# EAGLE design Marklin BR 128 21MTC Adapter (EAGLE 9.6.2)
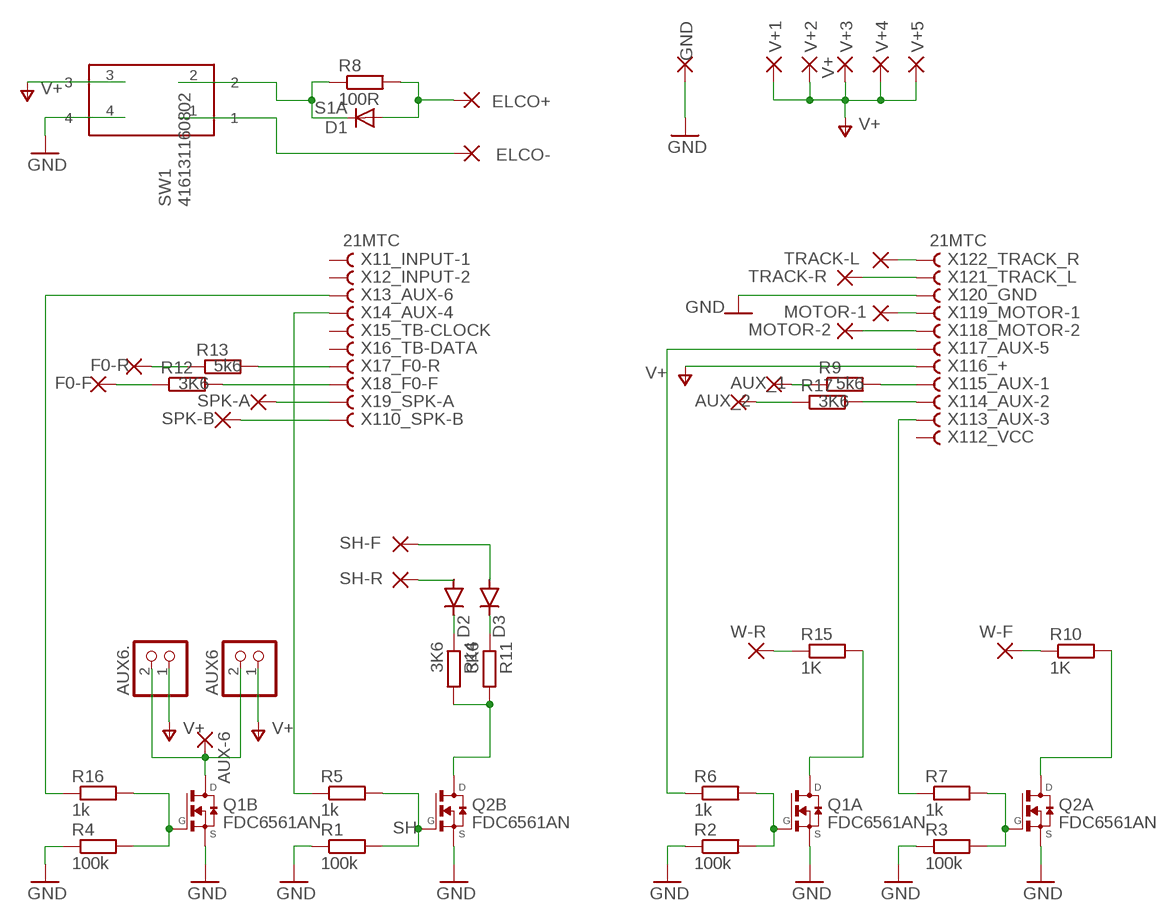
[diagram p0: schematic, sheet 1]

## Parts
AUX6  JST_2PIN-THM-RA  [JST-PH-2-THM-RA]
AUX6.  JST_2PIN-THM-RA  [JST-PH-2-THM-RA]
AUX-6  SMD2  [SMD1,27-2,54]
AUX_1  SMD2  [SMD1,27-2,54]
AUX_2  SMD2  [SMD1,27-2,54]
D1  S1A  [DO214AC]
D2  S1M  [SMA]
D3  S1M  [SMA]
ELCO+  SMD2  [SMD1,27-2,54]
ELCO-  SMD2  [SMD1,27-2,54]
F0-F  SMD2  [SMD1,27-2,54]
F0-R  SMD2  [SMD1,27-2,54]
GND  SMD2  [SMD1,27-2,54]
MOTOR-1  SMD2  [SMD1,27-2,54]
MOTOR-2  SMD2  [SMD1,27-2,54]
Q1  FDC6561AN  [SSOT-6]
Q2  FDC6561AN  [SSOT-6]
R1  100k  R-EU_R0603  [R0603]
R2  100k  R-EU_R0603  [R0603]
R3  100k  R-EU_R0603  [R0603]
R4  100k  R-EU_R0603  [R0603]
R5  1k  R-EU_R0603  [R0603]
R6  1k  R-EU_R0603  [R0603]
R7  1k  R-EU_R0603  [R0603]
R8  100R  R-EU_R0603  [R0603]
R9  5k6  R-EU_R0603  [R0603]
R10  1K  R-EU_R0603  [R0603]
R11  3K6  R-EU_R0603  [R0603]
R12  3K6  R-EU_R0603  [R0603]
R13  5k6  R-EU_R0603  [R0603]
R14  3K6  R-EU_R0603  [R0603]
R15  1K  R-EU_R0603  [R0603]
R16  1k  R-EU_R0603  [R0603]
R17  3K6  R-EU_R0603  [R0603]
SH-F  SH  SMD2  [SMD1,27-2,54]
SH-R  AUX-2_(SH)  SMD2  [SMD1,27-2,54]
SPK-A  SMD2  [SMD1,27-2,54]
SPK-B  SMD2  [SMD1,27-2,54]
SW1  416131160802  [416131160802]
TRACK-L  SMD2  [SMD1,27-2,54]
TRACK-R  SMD2  [SMD1,27-2,54]
V+1  SMD2  [SMD1,27-2,54]
V+2  SMD2  [SMD1,27-2,54]
V+3  V+  SMD2  [SMD1,27-2,54]
V+4  SMD2  [SMD1,27-2,54]
V+5  SMD2  [SMD1,27-2,54]
W-F  AUX-1_(W)  SMD2  [SMD1,27-2,54]
W-R  AUX-1_(W)  SMD2  [SMD1,27-2,54]
X1  21MTC  [21MTC]

## Nets
ELCO+ [V+]: D1.A ELCO+.1(P) R8.2
ELCO- [GND]: ELCO-.1(P) SW1.1
GND [GND]: GND.1(P) Q1.2(B:S) Q1.5(A:S) Q2.2(B:S) Q2.5(A:S) R1.1 R2.1 R3.1 R4.1 SW1.4 X1.20
MOTOR2 [Motor]: MOTOR-2.1(P) X1.18
MOTOR-1 [Motor]: MOTOR-1.1(P) X1.19
N$1: R7.1 X1.13
N$2: Q2.1(A:G) R3.2 R7.2
N$3: R5.1 X1.4
N$4: Q2.3(B:G) R1.2 R5.2
N$5: AUX6.2 AUX6..2 AUX-6.1(P) Q1.4(B:D)
N$6: Q1.1(A:G) R2.2 R6.2
N$7: R6.1 X1.17
N$8: R16.1 X1.3
N$10 [V+]: D1.C R8.1 SW1.2
N$12: Q1.3(B:G) R4.2 R16.2
N$13: D2.A SH-R.1(P)
N$15: Q1.6(A:D) R15.2
N$16: R10.1 W-F.1(P)
N$17: D3.A SH-F.1(P)
N$22: R13.2 X1.7
N$23: R12.2 X1.8
N$24: SPK-A.1(P) X1.9
N$25: SPK-B.1(P) X1.10
N$26: Q2.4(B:D) R11.2 R14.2
N$27: D2.C R14.1
N$29: R15.1 W-R.1(P)
N$31: D3.C R11.1
N$32: R9.2 X1.15
N$33: R17.2 X1.14
N$34: AUX_1.1(P) R9.1
N$35: AUX_2.1(P) R17.1
N$36: Q2.6(A:D) R10.2
N$37: F0-F.1(P) R12.1
N$38: F0-R.1(P) R13.1
TRACK-L [DCC]: TRACK-L.1(P) X1.22
TRACK-R [DCC]: TRACK-R.1(P) X1.21
V+ [V+]: AUX6.1 AUX6..1 SW1.3 V+1.1(P) V+2.1(P) V+3.1(P) V+4.1(P) V+5.1(P) X1.16
Unconnected: X1.1 X1.2 X1.5 X1.6 X1.12

## Library data of the parts
AUX6 AUX6. = adafruit:JST_2PIN: JST 2-Pin Connectors of various flavors SMT-RA (S2B-PH-SM4) 4UConnector #17311 SMT (B2B-PH-SM4) THM-RA (S2B-PH) THM (B2B-PH)
AUX-6 AUX_1 AUX_2 ELCO+ ELCO- F0-F F0-R GND MOTOR-1 MOTOR-2 SH-F SH-R SPK-A SPK-B TRACK-L TRACK-R V+1-V+5 W-F W-R = wirepad:SMD2: SMD PAD
D1 = s1x_10:S1*: S1A - S1M General Purpose Rectifiers Source: http://www.fairchildsemi.com/datasheets/S1/S1A.pdf; MF: Fairchild; MPN: S1A; OC_FARNELL: 9843868; OC_NEWARK: 58K9551
D2 D3 = diode:S1M
Q1 Q2 = FDC6561AN:FDC6561AN: Dual N-Channel MOSFET Logic Level PowerTrench; DESCRIPTION: Mosfet Array 2 N-Channel (Dual) 30V 2.5A 700mW Surface Mount SuperSOT™-6; DIGI-KEY_PART_NUMBER: FDC6561ANCT-ND; MF: ON Semiconductor; MP: FDC6561AN; PACKAGE: SOT-23-6 IPG; PURCHASE-URL: https://pricing.snapeda.com/search/part/FDC6561AN/?ref=eda
R1-R17 = rcl:R-EU_: RESISTOR, European symbol; SPICEPREFIX: R
SW1 = Wurth_Elektronik_Electromechanic_Switchs_rev15b:416131160802: WS-HP-1.27 mm small compact SMD Dip Switch with top tape,4 pins,2 poles
X1 = 21MTC:21MTC: 1.27mm SINGLE ROW FEMALE SOCKET Source: http://www.leotronics.co.uk/Conexcon/Data%20Sheets/sec.%20A/1296ing.pdf; OC_FARNELL: unknown; OC_NEWARK: unknown

## Net classes
1 DCC: width 0.254 mm
2 Motor: width 0.254 mm
3 GND: width 0.254 mm
4 V+: width 0.254 mm

## Board
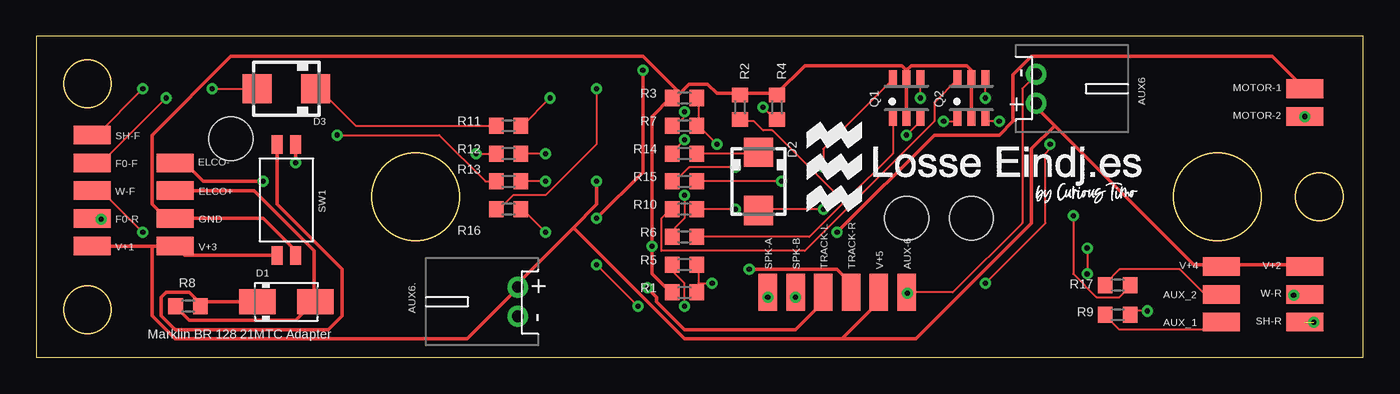
[diagram p1: board, top side]
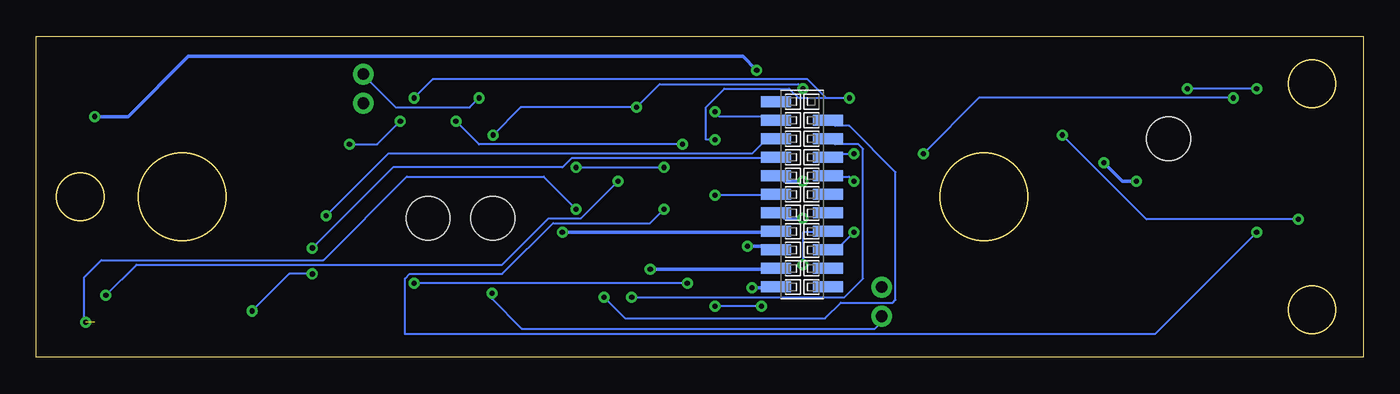
[diagram p2: board, bottom side, seen from below]

Size 91 x 22 mm. Coordinates in mm from the lower left corner, seen from the top.
Outline: 0,0 91,0 91,22 0,22 0,0
Outline: circle at 88,11 radius 1.62
Outline: circle at 3.5,3.25 radius 1.62
Outline: circle at 3.5,18.75 radius 1.62
Outline: circle at 81,11 radius 3
Outline: circle at 26,11 radius 3
Copper layers (1*16): Top 0.035mm / dielectric 1.5mm / Bottom 0.035mm
Design rules "default": minimum track width 6mil, minimum drill 0.35mm, track to track 6mil, track to pad 6mil, pad to pad 6mil, via to via 6mil, smd to smd 6mil, copper to edge 40mil, drill to drill 6mil, minimum pad ring 10mil, minimum via ring 8mil, stop-mask expansion 4mil, vias tented up to drill 0mil, thermal gap 10mil
Holes 3 mm at 59.69,9.53 64.14,9.53 13.34,14.99

### Footprints (pad centres in the part's own frame; a part is rotated, then mirrored left to right if it is on the bottom)
JST-PH-2-THM-RA = drill 0.8 pad 1.422: 1 1,0; 2 -1,0
SMD1,27-2,54 = smd 1.27 x 2.54: 1 0,0
DO214AC = smd 2.5 x 1.7: A 2,0; C -2,0
SMA = smd 2 x 2: A 2,0; C -2,0
SSOT-6 = smd 0.55 x 1.2: 1 -0.95,-1.3; 2 0,-1.3; 3 0.95,-1.3; 4 0.95,1.3; 5 0,1.3; 6 -0.95,1.3
R0603 = smd 1 x 1.1: 1 -0.85,0; 2 0.85,0
416131160802 = smd 0.76 x 1.27: 1 0,-3.81; 2 1.27,-3.81; 3 1.27,3.81; 4 0,3.81
21MTC = smd 0.76 x 2.05: 1 -6.35,-1.78; 2 -5.08,-1.78; 3 -3.81,-1.78; 4 -2.54,-1.78; 5 -1.27,-1.78; 6 0,-1.78; 7 1.27,-1.78; 8 2.54,-1.78; 9 3.81,-1.78; 10 5.08,-1.78; 12 6.35,1.78; 13 5.08,1.78; 14 3.81,1.78; 15 2.54,1.78; 16 1.27,1.78; 17 0,1.78; 18 -1.27,1.78; 19 -2.54,1.78; 20 -3.81,1.78; 21 -5.08,1.78; 22 -6.35,1.78

### Placement (x,y rotation side)
AUX6  68.58,18.41 270 top
AUX6.  33.02,3.81 90 top
AUX-6  59.69,4.45 0 top
AUX_1  81.28,2.41 90 top
AUX_2  81.28,4.32 90 top
D1  17.14,3.81 0 top
D2  49.53,12.06 270 top
D3  17.14,18.41 180 top
ELCO+  9.53,11.43 90 top
ELCO-  9.53,13.34 270 top
F0-F  3.81,13.34 90 top
F0-R  3.81,9.53 270 top
GND  9.53,9.53 90 top
MOTOR-1  87,18.41 90 top
MOTOR-2  87,16.51 90 top
Q1  59.69,17.78 0 top
Q2  64.14,17.78 0 top
R1  44.45,4.45 0 top
R2  48.26,17.14 270 top
R3  44.45,17.78 0 top
R4  50.8,17.14 270 top
R5  44.45,6.35 0 top
R6  44.45,8.26 0 top
R7  44.45,15.88 0 top
R8  10.4,3.51 180 top
R9  74.17,2.92 0 top
R10  44.45,10.16 180 top
R11  32.38,15.88 0 top
R12  32.38,13.97 0 top
R13  32.38,12.06 0 top
R14  44.45,13.97 180 top
R15  44.45,12.06 180 top
R16  32.38,10.16 180 top
R17  74.17,4.95 0 top
SH-F  3.81,15.24 90 top
SH-R  87,2.41 90 top
SPK-A  50.16,4.45 0 top
SPK-B  52.07,4.45 0 top
SW1  17.78,10.79 180 top
TRACK-L  53.98,4.45 0 top
TRACK-R  55.88,4.45 0 top
V+1  3.81,7.62 90 top
V+2  87,6.22 90 top
V+3  9.53,7.62 90 top
V+4  81.28,6.22 90 top
V+5  57.78,4.45 0 top
W-F  3.81,11.43 90 top
W-R  87,4.32 90 top
X1  38.48,11.18 90 bottom

### Tracks (layer width: path | path; a pad name or v marks a point on that pad's centre or on a via)
ELCO+
  Top 0.254: 19.05,3.81 17.78,2.54 10.48,2.54 9.84,3.17 9.84,3.49 R8.2 | ELCO+.1 14.92,11.43 19.05,7.3 19.05,3.81 | 19.05,3.81 D1.A
ELCO-  (via drill 0.35)
  Top 0.254: v17.78,13.34 SW1.1 | v15.56,12.06 11.43,12.06 10.16,13.34 ELCO-.1
  Bottom 0.254: v17.78,13.34 16.51,12.06 v15.56,12.06
GND  (via drill 0.35)
  Top 0.254: SW1.4 17.78,7.3 15.56,9.53 GND.1 8.89,9.53 7.94,10.48 7.94,15.24 13.34,20.64 41.59,20.64 44.13,18.1 | Q1.2 Q1.5 59.69,19.68 | Q2.2 Q2.5 64.14,19.68 63.82,20 60.01,20 59.69,19.68 | 50.8,18.1 48.26,18.1 | R1.1 43.5,4.45 42.23,5.71 v42.23,7.62 42.23,16.51 43.5,17.78 R3.1 43.81,17.78 44.13,18.1 | 48.26,18.1 46.67,18.1 46.04,18.73 44.77,18.73 44.13,18.1 | 48.26,18.1 R2.1 | 59.69,19.68 59.37,20 52.7,20 50.8,18.1 | 50.8,18.1 R4.1
  Bottom 0.254: v42.23,7.62 40.32,7.62 X1.20
MOTOR2  (via drill 0.35)
  Top 0.254: v38.42,9.53 41.59,12.7 v41.59,19.68
  Bottom 0.254: v38.42,9.53 39.69,9.53 40.01,9.84 X1.18 | v41.59,19.68 42.55,20.64 80.58,20.64 84.71,16.51 MOTOR-2.1
  other vias: 87,16.51
MOTOR-1  (via drill 0.35)
  Top 0.254: v54.93,8.57 61.59,15.24 66.04,15.24 66.99,16.19 66.99,19.37 68.26,20.64 84.77,20.64 MOTOR-1.1
  Bottom 0.254: v54.93,8.57 40.32,8.57 X1.19
N$1  (via drill 0.35)
  Top 0.152: v44.45,16.83 44.45,16.51 43.81,15.88 R7.1
  Bottom 0.152: v44.45,16.83 44.13,16.51 40.32,16.51 X1.13
N$2  (via drill 0.35)
  Top 0.152: 45.4,15.88 45.4,17.78 R3.2 | v62.23,16.19 63.18,16.19 Q2.1 | 45.4,15.88 v46.67,14.61 | 45.4,15.88 R7.2
  Bottom 0.152: v62.23,16.19 60.64,14.61 v46.67,14.61
N$3  (via drill 0.35)
  Top 0.152: v44.45,3.49 44.45,5.08 43.81,5.71 43.81,6.35 R5.1 | v38.42,6.35 v41.27,3.49
  Bottom 0.152: v41.27,3.49 v44.45,3.49 | v38.42,6.35 38.42,8.57 36.83,8.57 X1.4
N$4  (via drill 0.35)
  Top 0.152: 45.4,5.08 45.4,6.35 R5.2 | 45.4,5.08 45.4,4.45 R1.2 | v66.04,16.19 65.09,16.19 Q2.3 | v69.53,14.61 69.53,14.29 69.22,13.97 69.22,9.21 v65.09,5.08 | 45.4,5.08 v46.35,5.08
  Bottom 0.152: v66.04,16.19 67.63,14.61 v69.53,14.61 | v46.35,5.08 v65.09,5.08
N$5  (via drill 0.35)
  Top 0.152: v60.64,17.78 60.64,19.05 Q1.4 | 59.82,4.45 62.87,4.45 67.63,9.21 67.63,18.41 68.58,19.37 AUX6.2 | 59.82,4.45 AUX-6.1 | 59.82,4.45 v59.75,4.38
  Bottom 0.152: v60.64,17.78 61.28,17.14 66.36,17.14 68.58,19.37 AUX6.2 | AUX6..2 33.02,2.43 33.48,1.97 57.72,1.97 59.75,4 v59.75,4.38
N$6
  Top 0.152: R6.2 53.02,8.26 55.56,10.79 | 55.56,10.79 58.74,13.97 58.74,16.19 Q1.1 | 55.56,10.79 55.24,10.79 50.48,15.56 49.85,15.56 49.21,16.19 48.26,16.19 R2.2
N$7  (via drill 0.35)
  Top 0.152: v44.45,11.11 44.45,9.53 43.81,8.89 43.81,8.26 R6.1
  Bottom 0.152: v44.45,11.11 40.32,11.11 X1.17
N$8  (via drill 0.35)
  Top 0.152: v34.92,8.57 33.34,10.16 R16.1
  Bottom 0.152: v34.92,8.57 35.88,7.62 36.51,7.62 X1.3
N$10
  Top 0.254: D1.C 11.43,3.81 R8.1 11.11,3.81 10.48,4.45 8.89,4.45 8.57,4.13 8.57,2.86 9.53,1.91 20,1.91 20.95,2.86 20.95,6.03 16.51,10.48 SW1.2
N$12  (via drill 0.35)
  Top 0.152: v38.42,18.41 38.42,14.61 34.92,11.11 32.7,11.11 31.75,10.16 R16.2 | v49.85,17.14 50.8,16.19 R4.2 | v59.69,15.24 60.64,16.19 Q1.3
  Bottom 0.152: v38.42,18.41 38.73,18.73 48.26,18.73 v49.85,17.14 57.78,17.14 v59.69,15.24
N$13  (via drill 0.35)  (1 unrouted)
  Top 0.152: v53.98,10.16 49.53,10.16 D2.A
  Bottom 0.152: v53.98,10.16 56.2,12.38 65.6,12.38 71.31,6.67 86.55,6.67 87.76,5.46 87.76,2.54 v87.63,2.41
N$15  (via drill 0.35)
  Top 0.152: v47.94,13.02 44.77,13.02 43.81,12.06 R15.2 | v53.98,13.02 53.98,14.29 58.74,19.05 Q1.6
  Bottom 0.152: v53.98,13.02 v47.94,13.02
N$16  (via drill 0.35)
  Top 0.152: v47.94,10.16 R10.1 | v7.3,8.57 4.45,11.43 W-F.1
  Bottom 0.152: v47.94,10.16 48.9,9.21 55.56,9.21 59.05,5.71 65.41,5.71 65.72,5.4 65.72,1.59 14.29,1.59 v7.3,8.57
N$17  (via drill 0.35)
  Top 0.152: v12.06,18.41 D3.A | v7.3,18.41 4.13,15.24 SH-F.1
  Bottom 0.152: v7.3,18.41 v12.06,18.41
N$22  (via drill 0.35)
  Top 0.152: v34.92,12.06 R13.2
  Bottom 0.152: v34.92,12.06 35.24,12.38 36.51,12.38 X1.7
N$23  (via drill 0.35)
  Top 0.152: v34.92,13.97 R12.2
  Bottom 0.152: v34.92,13.97 36.51,13.97 X1.8
N$24  (via drill 0.35)
  Top 0.152: SPK-A.1 v50.16,4.13
  Bottom 0.152: v50.16,4.13 35.56,4.13 34.29,5.4 34.29,14.29 34.61,14.61 36.2,14.61 36.51,14.92 X1.9
N$25  (via drill 0.35)
  Top 0.152: SPK-B.1 v52.07,4.13
  Bottom 0.152: v52.07,4.13 50.61,2.67 36.91,2.67 35.82,3.75 32.26,3.75 32.07,3.94 32.07,12.7 35.24,15.88 36.2,15.88 36.51,16.19 X1.10
N$26  (via drill 0.35)
  Top 0.152: v35.24,17.78 33.34,15.88 R11.2 | v44.45,14.92 43.5,13.97 R14.2 | v65.09,17.78 65.09,19.05 Q2.4
  Bottom 0.152: 36.83,17.78 38.73,17.78 39.37,18.41 43.81,18.41 45.09,17.14 45.09,14.92 v44.45,14.92 | 36.83,17.78 v35.24,17.78 | v65.09,17.78 63.82,19.05 38.1,19.05 36.83,17.78
N$27
  Top 0.152: R14.1 49.53,13.97 D2.C
N$29  (via drill 0.35)
  Top 0.152: v51.12,12.06 R15.1 | W-R.1 86.93,4.25 v86.23,4.25
  Bottom 0.152: v51.12,12.06 53.66,9.53 55.88,9.53 59.05,6.35 84.14,6.35 v86.23,4.25
N$31
  Top 0.152: R11.1 21.91,15.88 19.37,18.41 D3.C
N$32  (via drill 0.35)
  Top 0.152: v76.2,3.17 75.25,3.17 R9.2 | v72.07,7.49 v72.07,5.71
  Bottom 0.152: v76.2,3.17 73.66,5.71 v72.07,5.71 | v72.07,7.49 66.55,13.02 54.93,13.02 54.29,13.65 40.32,13.65 X1.15
N$33  (via drill 0.35)
  Top 0.152: v71.12,9.72 71.12,5.71 72.71,4.13 74.3,4.13 74.93,4.76 R17.2
  Bottom 0.152: v71.12,9.72 66.86,13.97 41.91,13.97 40.96,14.92 40.32,14.92 X1.14
N$34
  Top 0.152: R9.1 73.34,2.86 74.3,1.91 80.96,1.91 81.28,2.22 AUX_1.1
N$35
  Top 0.152: R17.1 73.34,5.08 74.3,6.03 78.42,6.03 80.01,4.45 81.28,4.45 AUX_2.1
N$36
  Top 0.152: R10.2 43.5,10.16 42.86,9.53 42.86,7.3 52.7,7.3 61.59,16.19 61.59,17.46 63.18,19.05 Q2.6
N$37  (via drill 0.35)
  Top 0.152: v30.16,13.97 R12.1 | v8.89,17.78 4.45,13.34 F0-F.1
  Bottom 0.152: v30.16,13.97 26.35,17.78 v8.89,17.78
N$38  (via drill 0.35)
  Top 0.152: R13.1 30.8,12.06 27.62,15.24 v20.64,15.24 | v4.45,9.46 3.87,9.46 F0-R.1
  Bottom 0.152: v20.64,15.24 14.86,9.46 v4.45,9.46
TRACK-L  (via drill 0.35)
  Top 0.254: v41.91,4.76 42.55,4.13 42.55,3.81 44.45,1.91 52.07,1.91 53.98,3.81 TRACK-L.1
  Bottom 0.254: v41.91,4.76 40.32,4.76 X1.22
TRACK-R  (via drill 0.35)
  Top 0.254: v48.9,6.03 54.93,6.03 55.88,5.08 TRACK-R.1
  Bottom 0.254: v48.9,6.03 40.32,6.03 X1.21
V+  (via drill 0.35)
  Top 0.254: 81.28,6.35 87,6.35 V+2.1 | 69.85,15.88 79.38,6.35 81.28,6.35 | 69.85,15.88 68.58,17.14 AUX6.1 | 81.28,6.35 V+4.1 | SW1.3 10.16,6.99 V+3.1 7.94,7.62 | 7.94,7.62 V+1.1 | v38.42,12.06 38.42,10.48 36.83,8.89 | 36.83,8.89 33.02,5.08 AUX6..1 33.02,4.76 29.53,1.27 9.53,1.27 7.94,2.86 7.94,7.62 | V+5.1 57.78,3.81 55.24,1.27 | 55.24,1.27 44.45,1.27 36.83,8.89 | 69.85,15.88 68.26,14.29 68.26,9.21 60.33,1.27 55.24,1.27
  Bottom 0.254: v38.42,12.06 39.69,12.06 40.01,12.38 X1.16

### Text on the board
tNames: Marklin BR 128 21MTC Adapter | /Users/timo/Downloads/Losse Eindjes Huisstijl/Losse Eindjes.bmp | /Users/timo/Downloads/Losse Eindjes Huisstijl/Losse Eindjes.bmp
tValues: /Users/timo/Downloads/Losse Eindjes Huisstijl/Losse Eindjes.bmp